# EAGLE design motorboard (EAGLE 7.1.0)
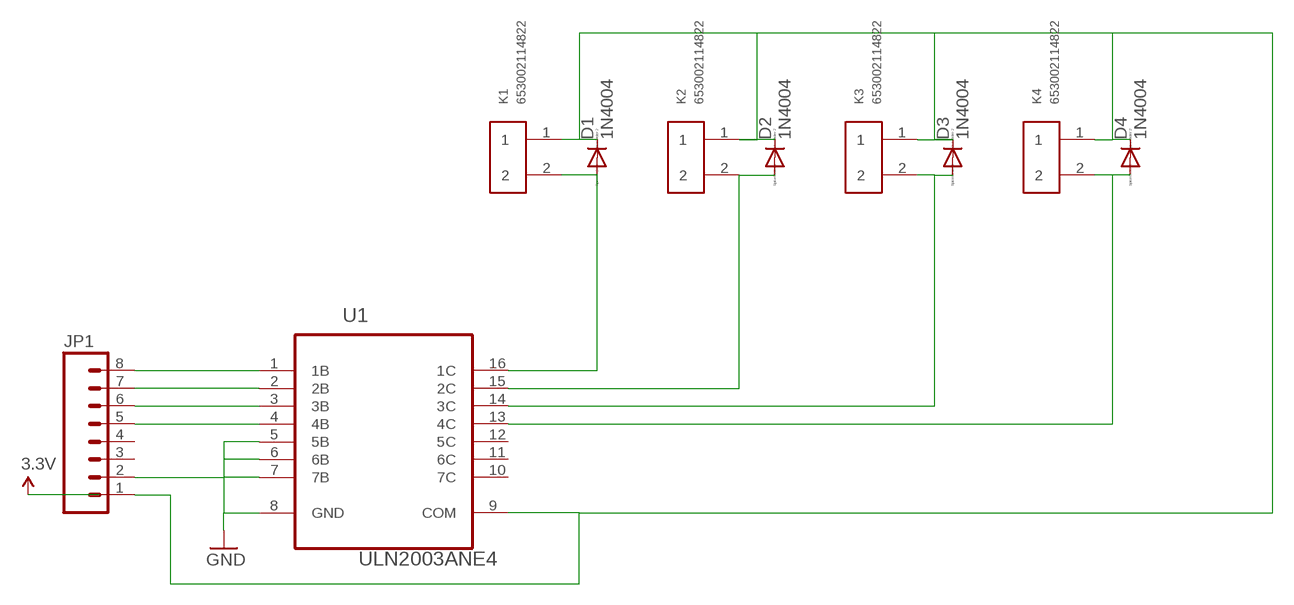
[diagram p0: schematic, sheet 1]

## Parts
D1  1N4004  [DO41-10]
D2  1N4004  [DO41-10]
D3  1N4004  [DO41-10]
D4  1N4004  [DO41-10]
JP1  M08NO_SILK_FEMALE_PTH  [1X08_NO_SILK]
K1  653002114822  [653002114822]
K2  653002114822  [653002114822]
K3  653002114822  [653002114822]
K4  653002114822  [653002114822]
U1  ULN2003ANE4  [DIP254P762X508-16]

## Nets
GND: JP1.2 U1.5(5B) U1.6(6B) U1.7(7B) U1.8(GND)
N$1: D1.C D2.C D3.C D4.C JP1.1 K1.1 K2.1 K3.1 K4.1 U1.9(COM)
N$3: JP1.8 U1.1(1B)
N$4: JP1.7 U1.2(2B)
N$5: JP1.6 U1.3(3B)
N$6: JP1.5 U1.4(4B)
N$7: D1.A K1.2 U1.16(1C)
N$8: D2.A K2.2 U1.15(2C)
N$9: D3.A K3.2 U1.14(3C)
N$10: D4.A K4.2 U1.13(4C)
Unconnected: JP1.3 JP1.4 U1.10(7C) U1.11(6C) U1.12(5C)

## Library data of the parts
D1-D4 = diode:1N4004: DIODE general purpose rectifier, 1 A; MF: NTE ELECTRONICS; MPN: 1N4004; OC_FARNELL: 2295710
JP1 = SparkFun-Connectors:M08: Header 8 Standard 8-pin 0.1" header. Use with straight break away headers (SKU : PRT-00116), right angle break away headers (PRT-00553), swiss pins (PRT-00743), machine pins (PRT-00117), and female headers (PRT-00115).; OC_FARNELL: unknown; PROD_ID: CONN-08438
K1-K4 = Wuerth_Elektronik_eiCan_Wire_to_Board_Connectors:653002114822: WR-WTB 1.25mm Male Vertical Shrouded Header, 2 Pins=>Code : Con_WTB_1.25_PCB_THT_653002114822 <http://katalog.we-online.de/media/thumbs2/eican/thb_Con_WTB_1.25_PCB_THT_6530xx114822_pf2.jpg> Details see: http://katalog.we-online.de/en/em/653_0xx_114_822 Created 2014-06-06, Karrer Zheng 2014 (C) Würth Elektronik; OC_FARNELL: unknown
U1 = Texas Instruments_By_element14_Batch_1:ULN2003ANE4: HIGH-VOLTAGE, HIGH-CURRENT DARLINGTON TRANSISTOR ARRAYS; MPN: ULN2003ANE4; OC_FARNELL: 1210973; OC_NEWARK: 98K2130; PACKAGE: PDIP-16; SUPPLIER: Texas Instruments

## Board
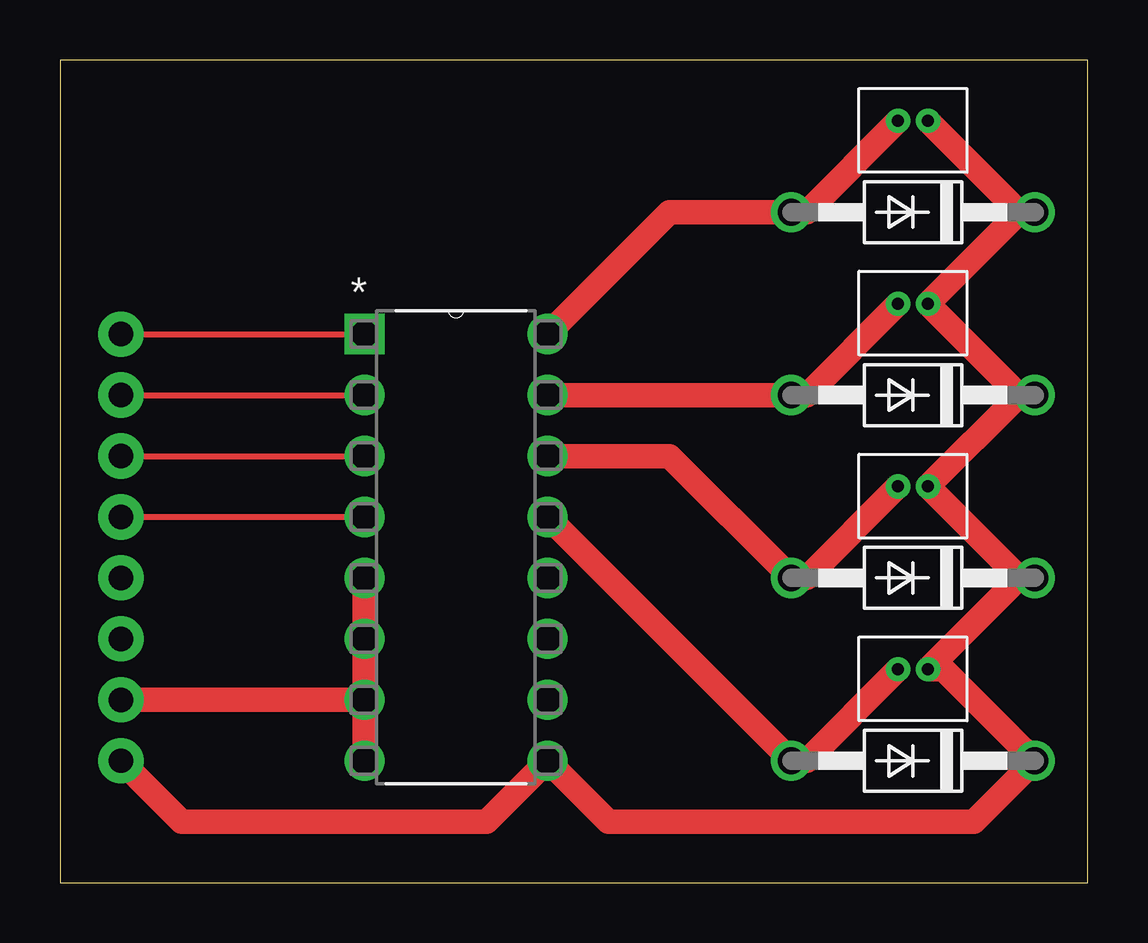
[diagram p1: board, top side]

Size 42.85 x 34.28 mm. Coordinates in mm from the lower left corner, seen from the top.
Outline: 0,0 42.85,0 42.85,34.28 0,34.28 0,0
Copper layers (1*16): Top 0.035mm / dielectric 1.5mm / Bottom 0.035mm
Design rules "default": minimum track width 10mil, minimum drill 24mil, track to track 8mil, track to pad 8mil, pad to pad 8mil, via to via 8mil, smd to smd 8mil, copper to edge 40mil, drill to drill 8mil, minimum pad ring 10mil, minimum via ring 8mil, stop-mask expansion 4mil, vias tented up to drill 0mil, thermal gap 10mil

### Footprints (pad centres in the part's own frame; a part is rotated, then mirrored left to right if it is on the bottom)
DO41-10 = drill 1.118: A 5.08,0; C -5.08,0
1X08_NO_SILK = drill 1.016 pad 1.88: 1 0,0; 2 2.54,0; 3 5.08,0; 4 7.62,0; 5 10.16,0; 6 12.7,0; 7 15.24,0; 8 17.78,0
653002114822 = drill 0.5: 1 0.625,0; 2 -0.625,0
DIP254P762X508-16 = drill 1.118 square: 1 -7.62,17.78 | drill 1.118: 2 -7.62,15.24; 3 -7.62,12.7; 4 -7.62,10.16; 5 -7.62,7.62; 6 -7.62,5.08; 7 -7.62,2.54; 8 -7.62,0; 9 0,0; 10 0,2.54; 11 0,5.08; 12 0,7.62; 13 0,10.16; 14 0,12.7; 15 0,15.24; 16 0,17.78

### Placement (x,y rotation side)
D1  35.56,27.94 180 top
D2  35.56,20.32 180 top
D3  35.56,12.7 180 top
D4  35.56,5.08 180 top
JP1  2.54,5.08 90 top
K1  35.56,31.75 0 top
K2  35.56,24.13 0 top
K3  35.56,16.51 0 top
K4  35.56,8.89 0 top
U1  20.32,5.08 0 top

### Tracks (layer width: path | path; a pad name or v marks a point on that pad's centre or on a via)
GND
  Top 1.016: JP1.2 U1.7 | U1.5 U1.6 U1.7 | U1.7 U1.8
N$1
  Top 1.016: JP1.1 5.08,2.54 17.78,2.54 U1.9 22.86,2.54 38.1,2.54 D4.C 36.83,8.89 K4.1 39.99,12.7 | 39.99,12.7 K3.1 39.99,20.32 | 39.99,12.7 D3.C | 39.99,20.32 K2.1 39.99,27.94 | 39.99,20.32 D2.C | K1.1 39.99,27.94 | 39.99,27.94 D1.C
N$3
  Top 0.254: JP1.8 U1.1
N$4
  Top 0.254: JP1.7 U1.2
N$5
  Top 0.254: JP1.6 U1.3
N$6
  Top 0.254: JP1.5 U1.4
N$7
  Top 1.016: K1.2 31.12,27.94 D1.A 25.4,27.94 U1.16
N$8
  Top 1.016: K2.2 31.12,20.32 D2.A U1.15
N$9
  Top 1.016: K3.2 31.12,12.7 D3.A 25.4,17.78 U1.14
N$10
  Top 1.016: K4.2 31.12,5.08 D4.A U1.13